# EAGLE design ButtonLed8 (EAGLE 6.0)
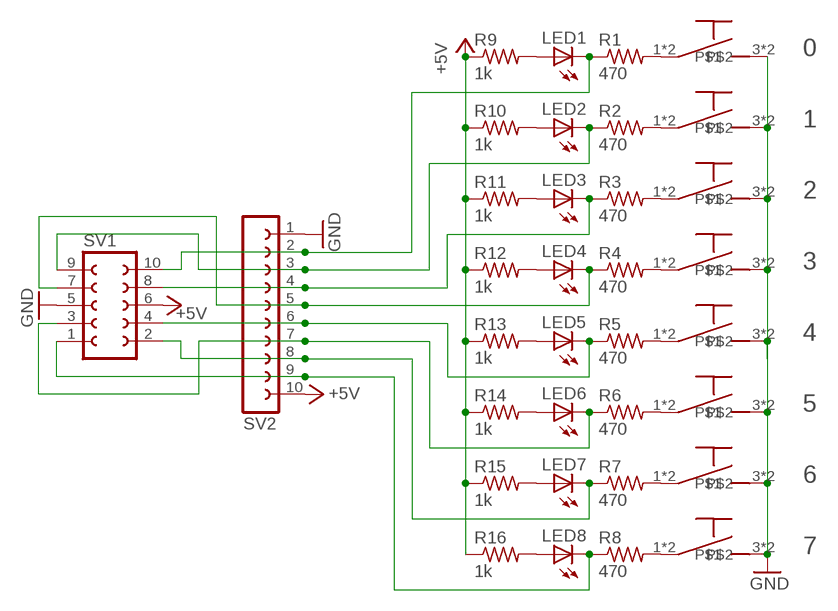
[diagram p0: schematic, sheet 1]

## Parts
LED1  LED3MM  [LED3MM]
LED2  LED3MM  [LED3MM]
LED3  LED3MM  [LED3MM]
LED4  LED3MM  [LED3MM]
LED5  LED3MM  [LED3MM]
LED6  LED3MM  [LED3MM]
LED7  LED3MM  [LED3MM]
LED8  LED3MM  [LED3MM]
R1  470  R-US_0204/7  [0204/7]
R2  470  R-US_0204/7  [0204/7]
R3  470  R-US_0204/7  [0204/7]
R4  470  R-US_0204/7  [0204/7]
R5  470  R-US_0204/7  [0204/7]
R6  470  R-US_0204/7  [0204/7]
R7  470  R-US_0204/7  [0204/7]
R8  470  R-US_0204/7  [0204/7]
R9  1k  R-US_0204/7  [0204/7]
R10  1k  R-US_0204/7  [0204/7]
R11  1k  R-US_0204/7  [0204/7]
R12  1k  R-US_0204/7  [0204/7]
R13  1k  R-US_0204/7  [0204/7]
R14  1k  R-US_0204/7  [0204/7]
R15  1k  R-US_0204/7  [0204/7]
R16  1k  R-US_0204/7  [0204/7]
SV1  FE05-2  [FE05-2]
SV2  FE10-1  [FE10]
U$1  BUTTON  [SPARKFUN_TACTILE-PTH]
U$2  BUTTON  [SPARKFUN_TACTILE-PTH]
U$3  BUTTON  [SPARKFUN_TACTILE-PTH]
U$4  BUTTON  [SPARKFUN_TACTILE-PTH]
U$5  BUTTON  [SPARKFUN_TACTILE-PTH]
U$6  BUTTON  [SPARKFUN_TACTILE-PTH]
U$7  BUTTON  [SPARKFUN_TACTILE-PTH]
U$8  BUTTON  [SPARKFUN_TACTILE-PTH]

## Nets
+5V: R9.1 R10.1 R11.1 R12.1 R13.1 R14.1 R15.1 R16.1 SV1.6 SV2.10
GND: SV1.5 SV2.1 U$1.3 U$1.4 U$2.3 U$2.4 U$3.3 U$3.4 U$4.3 U$4.4 U$5.3 U$5.4 U$6.3 U$6.4 U$7.3 U$7.4 U$8.3 U$8.4
N$1: R1.2 U$1.1 U$1.2
N$2: R2.2 U$2.1 U$2.2
N$3: R4.2 U$4.1 U$4.2
N$4: R5.2 U$5.1 U$5.2
N$5: R6.2 U$6.1 U$6.2
N$6: R7.2 U$7.1 U$7.2
N$7: R8.2 U$8.1 U$8.2
N$8: LED1.K(C) R1.1 SV1.10 SV2.2
N$10: LED3.K(C) R3.1 SV1.8 SV2.4
N$11: LED4.K(C) R4.1 SV1.7 SV2.5
N$12: LED5.K(C) R5.1 SV1.4 SV2.6
N$13: LED6.K(C) R6.1 SV1.3 SV2.7
N$14: LED7.K(C) R7.1 SV1.2 SV2.8
N$15: LED8.K(C) R8.1 SV1.1 SV2.9
N$16: R3.2 U$3.1 U$3.2
N$17: LED1.A R9.2
N$18: LED2.A R10.2
N$19: LED3.A R11.2
N$20: LED4.A R12.2
N$21: LED5.A R13.2
N$22: LED6.A R14.2
N$23: LED7.A R15.2
N$24: LED8.A R16.2
N$25: LED2.K(C) R2.1 SV1.9 SV2.3

## Notes on the sheet
- 0
- 1
- 2
- 3
- 4
- 5
- 6
- 7

## Library data of the parts
LED1-LED8 = led:LED: LED OSRAM: - CHIPLED LG R971, LG N971, LY N971, LG Q971, LY Q971, LO R971, LY R971 LH N974, LH R974 LS Q976, LO Q976, LY Q976 LO Q996 - Hyper CHIPLED LW Q18S LB Q993, LB Q99A, LB R99A - SideLED LS A670, LO A670, LY A670, LG A670, LP A670 LB A673, LV A673, LT A673, LW A673 LH A674 LY A675 LS A676, LA A676, LO A676, LY A676, LW A676 LS A679, LY A679, LG A679 - Hyper Micro SIDELED® LS Y876, LA Y876, LO Y876, LY Y876 LT Y87S - SmartLED LW L88C, LW L88S LB L89C, LB L89S, LG L890 LS L89K, LO L89K, LY L89K LS L896, LA L896, LO L896, LY L896 - TOPLED LS T670, LO T670, LY T670, LG T670, LP T670 LSG T670, LSP T670, LSY T670, LOP T670, LYG T670 LG T671, LOG T671, LSG T671 LB T673, LV T673, LT T673, LW T673 LH T674 LS T676, LA T676, LO T676, LY T676, LB T676, LH T676, LSB T676, LW T676 LB T67C, LV T67C, LT T67C, LS T67K, LO T67K, LY T67K, LW E67C LS E67B, LA E67B, LO E67B, LY E67B, LB E67C, LV E67C, LT E67C LW T67C LS T679, LY T679, LG T679 LS T770, LO T770, LY T770, LG T770, LP T770 LB T773, LV T773, LT T773, LW T773 LH T774 LS E675, LA E675, LY E675, LS T675 LS T776, LA T776, LO T776, LY T776, LB T776 LHGB T686 LT T68C, LB T68C - Hyper Mini TOPLED® LB M676 - Mini TOPLED Santana® LG M470 LS M47K, LO M47K, LY M47K Source: http://www.osram.convergy.de LUXEON: - LUMILED® LXK2-PW12-R00, LXK2-PW12-S00, LXK2-PW14-U00, LXK2-PW14-V00 LXK2-PM12-R00, LXK2-PM12-S00, LXK2-PM14-U00 LXK2-PE12-Q00, LXK2-PE12-R00, LXK2-PE12-S00, LXK2-PE14-T00, LXK2-PE14-U00 LXK2-PB12-K00, LXK2-PB12-L00, LXK2-PB12-M00, LXK2-PB14-N00, LXK2-PB14-P00, LXK2-PB14-Q00 LXK2-PR12-L00, LXK2-PR12-M00, LXK2-PR14-Q00, LXK2-PR14-R00 LXK2-PD12-Q00, LXK2-PD12-R00, LXK2-PD12-S00 LXK2-PH12-R00, LXK2-PH12-S00 LXK2-PL12-P00, LXK2-PL12-Q00, LXK2-PL12-R00 Source: www.luxeon.com KINGBRIGHT: KA-3528ASYC Source: www.kingbright.com
R1-R16 = resistor:R-US_: RESISTOR, American symbol
SV1 = con-lsta:FE05-2: FEMALE HEADER; OC_FARNELL: unknown; OC_NEWARK: unknown
SV2 = con-lsta:FE10-1: FEMALE HEADER; OC_FARNELL: unknown; OC_NEWARK: unknown
U$1-U$8 = Iodph:BUTTON

## Board
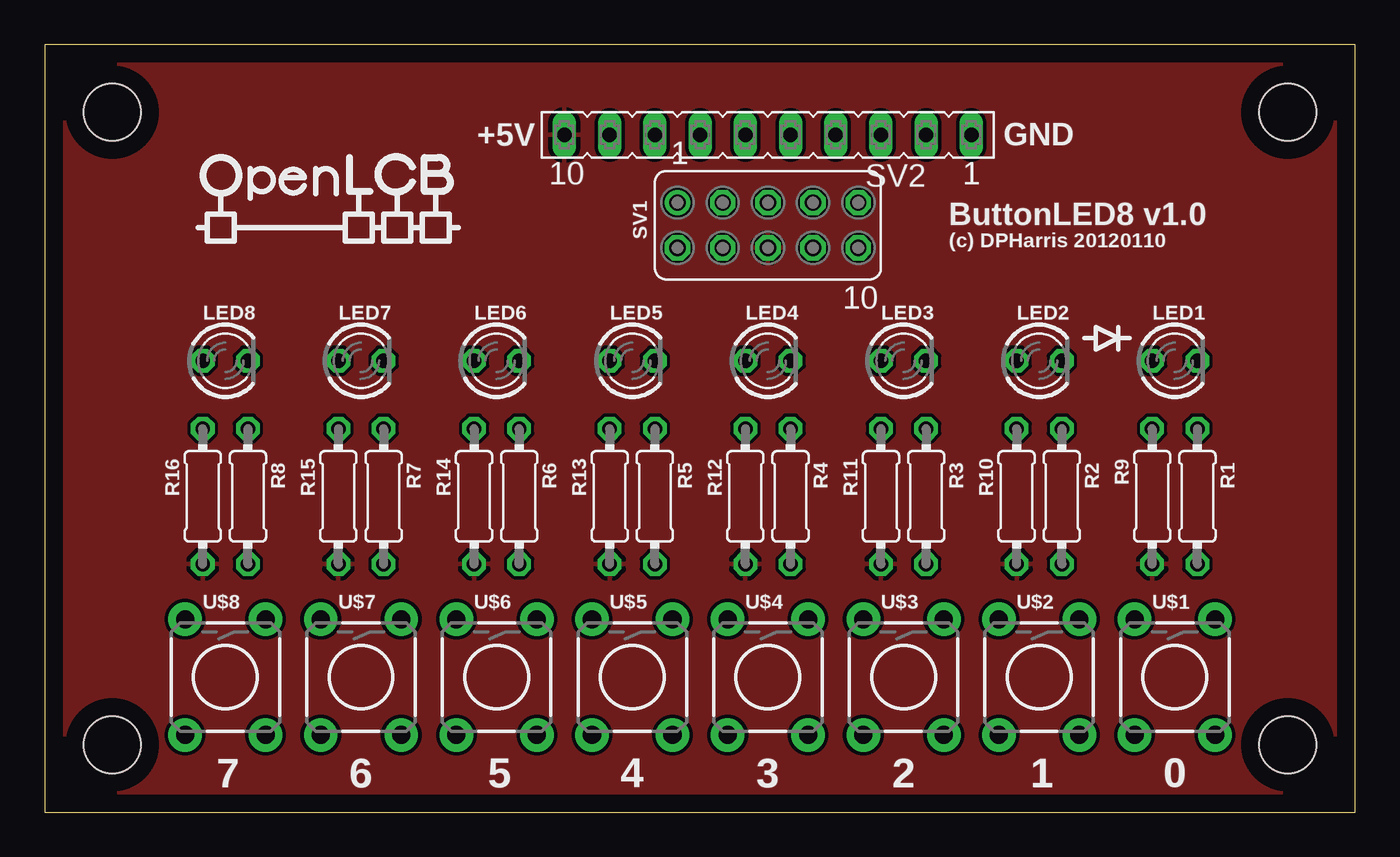
[diagram p1: board, top side]
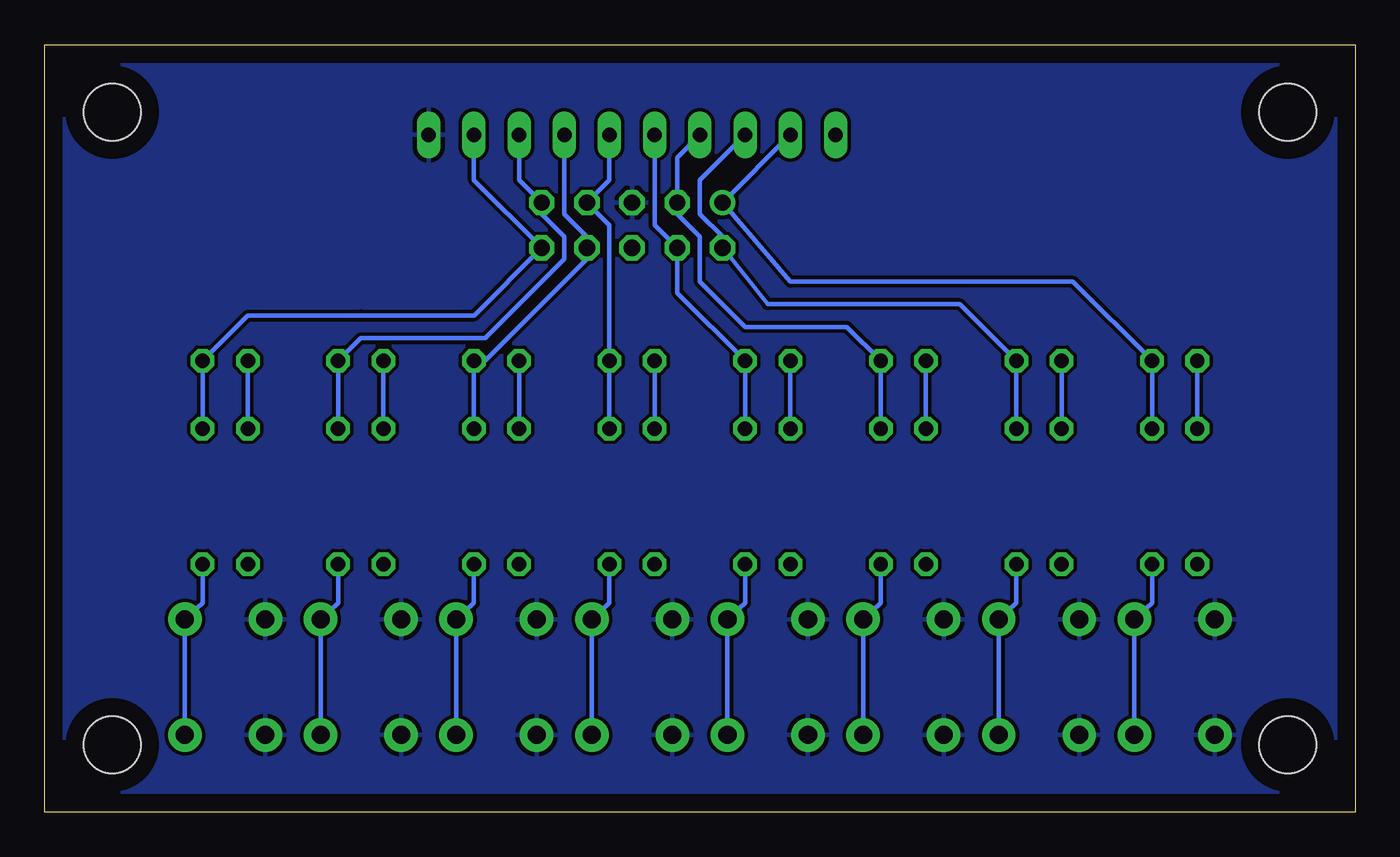
[diagram p2: board, bottom side, seen from below]

Size 73.65 x 43.16 mm. Coordinates in mm from the lower left corner, seen from the top.
Outline: 0,43.16 0,0 73.65,0 73.65,43.16 0,43.16
Copper layers (1*16): Top 0.035mm / dielectric 1.5mm / Bottom 0.035mm
Design rules: minimum track width 10mil, minimum drill 24mil, track to track 8mil, track to pad 8mil, pad to pad 8mil, via to via 8mil, smd to smd 8mil, copper to edge 40mil, drill to drill 8mil, minimum pad ring 10mil, minimum via ring 8mil, stop-mask expansion 4mil, vias tented up to drill 0mil, thermal gap 10mil
Holes 3.2 mm at 69.85,3.79 69.85,39.35 3.81,39.35 3.81,3.79

### Footprints (pad centres in the part's own frame; a part is rotated, then mirrored left to right if it is on the bottom)
LED3MM = drill 0.813 octagon: A -1.27,0; K 1.27,0
0204/7 = drill 0.813 octagon: 1 -3.81,0; 2 3.81,0
FE05-2 = drill 0.914: 1 -5.08,1.27 | drill 0.914 octagon: 2 -5.08,-1.27; 3 -2.54,1.27; 4 -2.54,-1.27; 5 0,1.27; 6 0,-1.27; 7 2.54,1.27; 8 2.54,-1.27; 9 5.08,1.27; 10 5.08,-1.27
FE10 = drill 0.813 long: 1 -11.43,0; 2 -8.89,0; 3 -6.35,0; 4 -3.81,0; 5 -1.27,0; 6 1.27,0; 7 3.81,0; 8 6.35,0; 9 8.89,0; 10 11.43,0
SPARKFUN_TACTILE-PTH = drill 1.016 pad 1.88: 1 -3.251,2.261; 2 3.251,2.261; 3 -3.251,-2.261; 4 3.251,-2.261

### Placement (x,y rotation side)
LED1  63.5,25.38 0 top
LED2  55.88,25.38 0 top
LED3  48.26,25.38 0 top
LED4  40.64,25.38 0 top
LED5  33.02,25.38 0 top
LED6  25.4,25.38 0 top
LED7  17.78,25.38 0 top
LED8  10.16,25.38 0 top
R1  64.77,17.76 270 top
R2  57.15,17.76 270 top
R3  49.53,17.76 270 top
R4  41.91,17.76 270 top
R5  34.29,17.76 270 top
R6  26.67,17.76 270 top
R7  19.05,17.76 270 top
R8  11.43,17.76 270 top
R9  62.23,17.76 90 top
R10  54.61,17.76 90 top
R11  46.99,17.76 90 top
R12  39.37,17.76 90 top
R13  31.75,17.76 90 top
R14  24.13,17.76 90 top
R15  16.51,17.76 90 top
R16  8.89,17.76 90 top
SV1  40.64,33 0 top
SV2  40.64,38.08 180 top
U$1  63.5,7.6 270 top
U$2  55.88,7.6 270 top
U$3  48.26,7.6 270 top
U$4  40.64,7.6 270 top
U$5  33.02,7.6 270 top
U$6  25.4,7.6 270 top
U$7  17.78,7.6 270 top
U$8  10.16,7.6 270 top
U$9  [OPENLCB_LOGOV]  8.26,31.73 0 top

### Tracks (layer width: path | path; a pad name or v marks a point on that pad's centre or on a via)
+5V
  pour Top: 74.93,44.43 74.93,-2.56 59.05,-2.56 -1.21,-2.42 -1.27,44.43
GND
  pour Bottom: 74.93,44.43 74.93,-2.56 74.92,-2.56 -1.11,-2.39 -1.27,-2.39 -1.27,44.43
N$1
  Bottom 0.254: R1.2 64.77,11.77 U$1.1 U$1.2
N$2
  Bottom 0.254: R2.2 57.15,11.77 U$2.1 U$2.2
N$3
  Bottom 0.254: R4.2 41.91,11.77 U$4.1 U$4.2
N$4
  Bottom 0.254: R5.2 34.29,11.77 U$5.1 U$5.2
N$5
  Bottom 0.254: R6.2 26.67,11.77 U$6.1 U$6.2
N$6
  Bottom 0.254: R7.2 19.05,11.77 U$7.1 U$7.2
N$7
  Bottom 0.254: R8.2 11.43,11.77 U$8.1 U$8.2
N$8
  Bottom 0.254: R1.1 LED1.K 62.23,27.92 55.88,27.92 55.87,27.93 49.52,27.93 SV1.10 49.53,35.54 SV2.2
N$10
  Bottom 0.254: R3.1 LED3.K 48.9,25.38 43.18,31.1 SV1.8 43.18,32.37 44.45,33.64 SV2.4
N$11
  Bottom 0.254: R4.1 LED4.K 41.91,33 SV1.7 41.91,35.54 SV2.5
N$12
  Bottom 0.254: R5.1 LED5.K 38.1,29.19 SV1.4 39.37,33 SV2.6
N$13
  Bottom 0.254: R6.1 LED6.K 28.57,27.29 34.29,27.29 36.83,29.83 36.83,32.37 38.1,33.64 SV1.3 38.1,36.81 SV2.7
N$14
  Bottom 0.254: R7.1 LED7.K 22.23,28.56 33.02,28.56 SV1.2 35.56,32.37 36.83,33.64 36.83,35.54 SV2.8
N$15
  Bottom 0.254: R8.1 LED8.K 15.88,29.83 31.75,29.83 SV1.1 SV2.9
N$16
  Bottom 0.254: R3.2 49.53,11.77 U$3.1 U$3.2
N$17
  Bottom 0.254: R9.2 LED1.A
N$18
  Bottom 0.254: R10.2 LED2.A
N$19
  Bottom 0.254: LED3.A R11.2
N$20
  Bottom 0.254: LED4.A R12.2
N$21
  Bottom 0.254: R13.2 LED5.A
N$22
  Bottom 0.254: R14.2 LED6.A
N$23
  Bottom 0.254: R15.2 LED7.A
N$24
  Bottom 0.254: R16.2 LED8.A
N$25
  Bottom 0.254: R2.1 LED2.K 55.88,26.65 48.9,26.65 44.45,31.1 44.45,32.37 45.72,33.64 SV1.9 46.99,35.54 SV2.3

### Text on the board
tPlace: GND | +5V | 7 | 6 | 5 | 4 | 3 | 2 | 1 | 0
tNames: ButtonLED8 v1.0 | (c) DPHarris 20120110